# Altium schematic sheet SPI-主板-开关.SCHDOC
size A4; PageSetup: Record=PageOptions|CenterHorizontal=True|CenterVertical=True|PrintScale=0.96|XCorrection=1.00|YCorrection=1.00|PrintKind=2|BorderSize=5000000|LeftOffset=0|BottomOffset=0|Orientation=2|PaperLength=1000|PaperWidth=1000|Scale=100|PaperSource=7|PrintQuality=-4|MediaType=1|DitherType=10|PaperKind=A4|PrintScaleMode=1
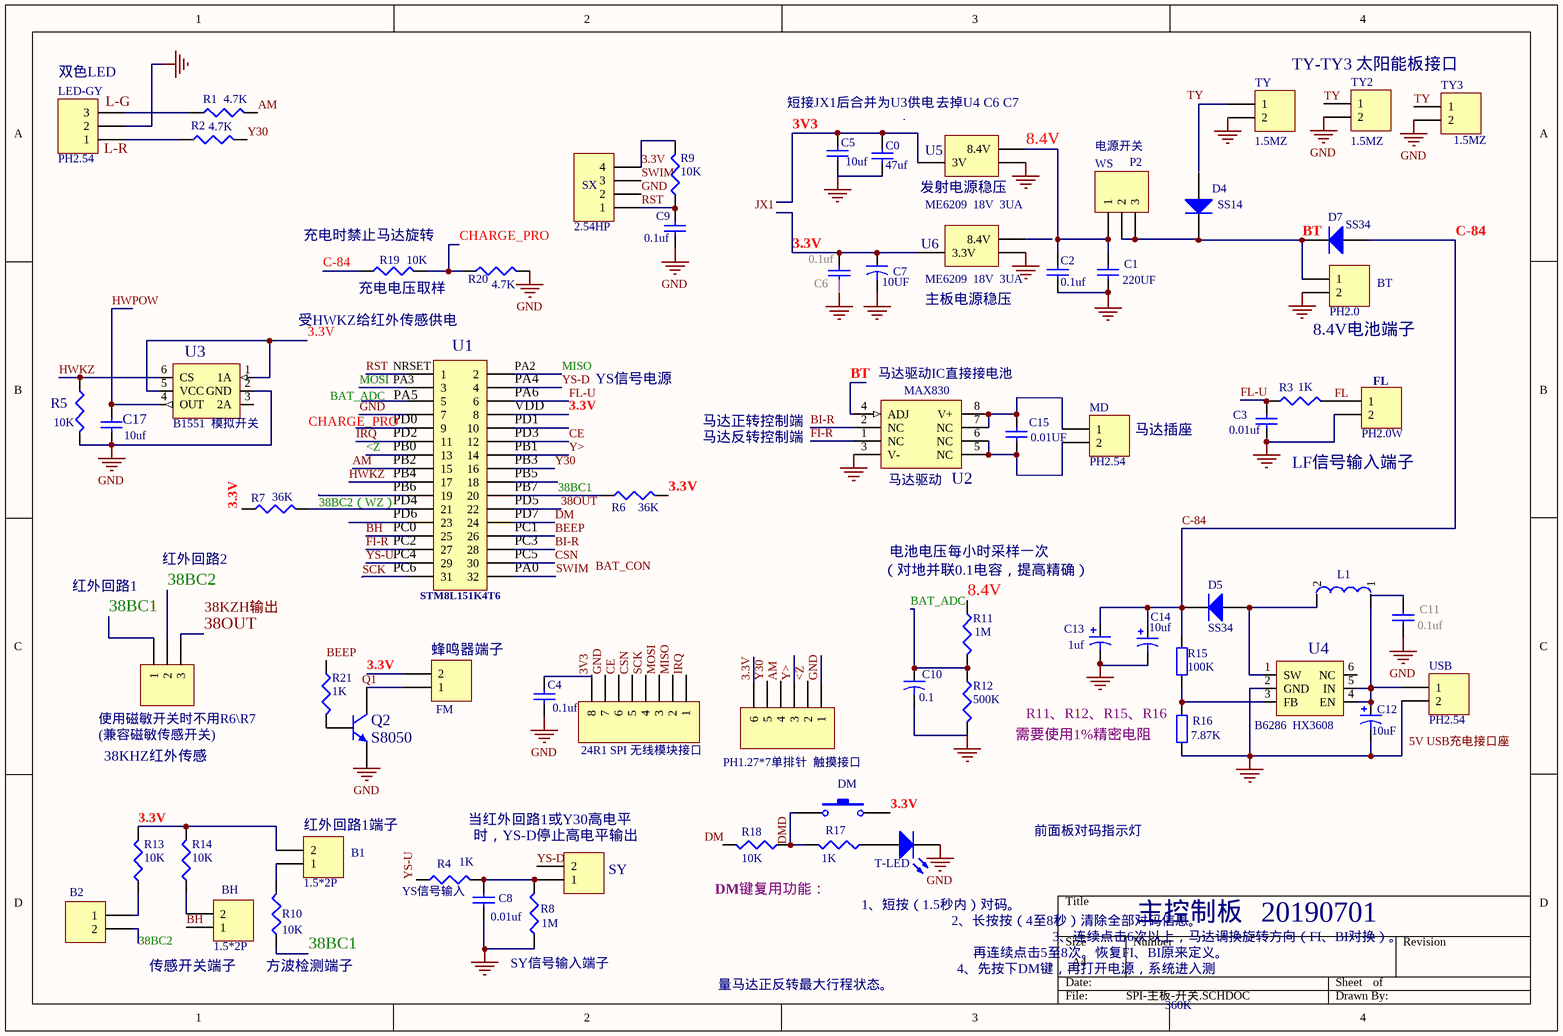
[diagram p0: SPI-主板-开关.SCHDOC]

## Parts
24R1_SPI_无线模块接口  Header 8  [HDR1X8]  (value not drawn)
(兼容磁敏传感开关)  PH2.0  [HDR1X3]  (value not drawn)
B1  1.5*2P  [HDR1X2]
B2  1.5*2P  [HDR1X2]  (value not drawn)
BH  1.5*2P  [HDR1X2]
BT  PH2.0  [HDR1X2]
C0  value 47uf  [CC1608-0603]
C1  value 220UF  [CC3216-1206]  (hidden comment: Cap Semi)
C2  value 0.1uf  [CC1608-0603]  (hidden comment: Cap Semi)
C3  0.01uf  [CC1608-0603]
C4  value 0.1uf  [CC1608-0603]
C5  10uf  [CC1608-0603]
C6  value 0.1uf  [CC1608-0603]  (hidden comment: 10UF)
C7  10UF  [CAPPR2-5x6.8]
C8  0.01uf  [CC1608-0603]
C9  value 0.1uf  [CC1608-0603]  (hidden comment: Cap Semi)
C10  value 0.1  [CAPPR2-5x6.8]  (hidden comment: 10UF)
C11  value 0.1uf  [CC3216-1206]  (hidden comment: Cap Semi)
C12  value 10uF  [C0805]  (hidden comment: Cap Pol1)
C13  value 1uf  [CC3216-1206]
C14  value 10uf  [CC3216-1206]
C15  0.01UF  [CC1608-0603]
C17  10uf  [CC1608-0603]
D4  SS14  [DIO7.1-3.9x1.9]
D5  SS34  [D0805]
D7  SS34  [D0805]
DM  (no value)  [SPST-2]
FL  PH2.0W  [HDR1X2]
FM  (no value)  [HDR1X2]
L1  (no value)  [L7]
LED-GY  PH2.54  [HDR1X3]
MD  PH2.54  [HDR1X2]
PH1.27*7单排针_触摸接口  Header 6  [HDR1X6]  (value not drawn)
Q2  S8050  [BCY-W3/E4]
R1  value 4.7K  [C1608-0603]
R2  value 4.7K  [C1608-0603]
R3  value 1K  [C1608-0603]
R4  value 1K  [C1608-0603]
R5  value 10K  [C1608-0603]
R6  value 36K  [C1608-0603]
R7  value 36K  [C1608-0603]
R8  value 1M  [C1608-0603]
R9  value 10K  [C1608-0603]
R10  value 10K  [C1608-0603]
R11  1M  value 360K  [C1608-0603]
R12  value 500K  [C1608-0603]
R13  value 10K  [C1608-0603]
R14  value 10K  [C1608-0603]
R15  value 100K  [C0805]  (hidden comment: Res2)
R16  value 7.87K  [C0805]  (hidden comment: Res2)
R17  value 1K  [C1608-0603]
R18  value 10K  [C1608-0603]
R19  10K  [C1608-0603]
R20  4.7K  [C1608-0603]
R21  value 1K  [C1608-0603]
SX  2.54HP  [HDR1X4]
SY  PH2.0WJ  [HDR1X2]  (value not drawn)
T-LED  (no value)  [LED-1]
TY  1.5MZ  [HDR1X2]
TY2  1.5MZ  [HDR1X2]
TY3  1.5MZ  [HDR1X2]
U1  STM8L151K4T6  [HDR2X16]
U2  马达驱动  Publisher: MAX830  [SO8]
U3  B1551  模拟开关  [2308]
U4  B6286  HX3608  [2308]
U5  ME6209  18V  3UA  [MHDR2X2]
U6  ME6209  18V  3UA  [MHDR2X2]
USB  PH2.54  [HDR1X2]
WS  P2  [HDR1X3]

## Nets
GND: 24R1_SPI_无线模块接口.7 BT.2 C0.1 C1.2 C2.1 C3.1 C4.1 C6.1 C7.2 C8.1 C9.1 C10.2 C11.2 C12.2 C13.2 C14.2 C17.1 FL.2 LED-GY.2 PH1.27*7单排针_触摸接口.1 R5.1 R8.1 R12.1 R16.2 R20.2 SX.2 T-LED.2(K) TY.2 TY2.2 TY3.2 U1.7 U2.3(V-) U3.2(GND) U4.2(GND) U5.3.3OUT U6.3.3OUT USB.2
3.3V: B1.2 C6.2 C7.1 DM.2 FM.2 PH1.27*7单排针_触摸接口.6 R6.2 R7.1 R9.2 R13.2 R14.2 SX.4 U1.8 U3.1(1A) U3.5(VCC) U6.2(3.3V)
3V3: 24R1_SPI_无线模块接口.8 C0.2 C4.2 C5.2 U5.2(3V)
8.4V: C1.1 C2.2 R11.2 U5.3.3_IN(8.4V) WS.1
38BC1: (兼容磁敏传感开关).1 R6.1 R10.1 U1.20
38BC2: (兼容磁敏传感开关).2
38OUT: (兼容磁敏传感开关).3 U1.22
<Z: PH1.27*7单排针_触摸接口.2 U1.13
AM: PH1.27*7单排针_触摸接口.4 R1.2 U1.15
BAT_ADC: C10.1 R11.1 R12.2
BEEP: R21.1 U1.26
BH: BH.1 U1.25
BI-R: U1.28 U2.2(NC)
BT: BT.1 D4.2(K) D7.2(K) U2.4(ADJ) WS.2 WS.3
C-84: C13.1 C14.1 D5.2(K) D7.1(A) R15.1 R19.1
CE: 24R1_SPI_无线模块接口.6 U1.12
CHARGE_PRO: R19.2 R20.1
CSN: 24R1_SPI_无线模块接口.5 U1.30
DM: U1.24
DMD: DM.1 R17.1 R18.2
FI-R: U1.27 U2.1(NC)
FL: FL.1 R3.2
FL-U: C3.2 R3.1 U1.6
HWKZ: R5.2 U1.17 U3.6(CS)
HWPOW: C17.2 U3.4(OUT)
IRQ: 24R1_SPI_无线模块接口.1 U1.11
MISO: 24R1_SPI_无线模块接口.2 U1.2  [also labelled PA2]
MOSI: 24R1_SPI_无线模块接口.3 U1.3  [also labelled PA3]
NRSET: C9.2 R9.1 SX.1 U1.1  [also labelled RST]
SCK: 24R1_SPI_无线模块接口.4 U1.31
SWIM: SX.3 U1.32
TY: TY2.1 TY3.1
Y30: PH1.27*7单排针_触摸接口.5 R2.2 U1.16
Y>: PH1.27*7单排针_触摸接口.3 U1.14
YS-D: SY.2 U1.4
YS-U: R4.1 U1.29
NetB1_1: B1.1 R10.2
NetB2_1: B2.1 R13.1
NetBH_2: BH.2 R14.1
NetC8_2: C8.2 R4.2 R8.2 SY.1
NetC12_1: C12.1 L1.1 U4.4(EN) U4.5(IN) USB.1
NetC15_1: C15.1 MD.2 U2.5(NC) U2.6(NC)
NetC15_2: C15.2 MD.1 U2.7(NC) U2.8(V+)
NetD5_1: D5.1(A) L1.2 U4.1(SW)
NetFM_1: FM.1 Q2.3(C)
NetLED-GY_1: LED-GY.1 R2.1
NetLED-GY_3: LED-GY.3 R1.1
NetQ2_2: Q2.2(B) R21.2
NetR7_2: R7.2 U1.21
NetR15_2: R15.2 R16.1 U4.3(FB)
NetR17_2: R17.2 T-LED.1(A)

Not connected (* = marked no-connect by the designer): B2 2; C5 1; C11 1; D4 1(A); Q2 1(E); R18 1; TY 1; U1 5 9 10 18 19 23; U3 3(2A); U4 6(NC); U6 3.3 IN(8.4V)

## Notes on the sheet
- (near LED-GY) 双色LED
- 短接JX1后合并为U3供电
- (near U5) 去掉U4 C6 C7
- TY-TY3 太阳能板接口
- 电源开关
- (near R19) 充电时禁止马达旋转
- (near U5) 发射电源稳压
- (near R19) 充电电压取样
- 主板电源稳压
- (near U3) 受HWKZ给红外传感供电
- (near U1) PA4
- YS信号电源
- (near U2) 马达驱动IC直接接电池
- (near BT) 8.4V电池端子
- (near U1) PD0
- (near U1) PD2
- (near U1) PB0
- (near U1) PA5
- (near U1) PA6
- (near U1) PD1
- (near U1) PD3
- (near U1) PB1
- (near U1) VDD
- 马达正转控制端
- 马达反转控制端
- (near MD) 马达插座
- (near U1) PD4
- (near U1) PD6
- (near U1) PB2
- (near U1) PB4
- (near U1) PB6
- (near U1) PD5
- (near U1) PD7
- (near U1) PB3
- (near U1) PB5
- (near U1) PB7
- LF信号输入端子
- 红外回路2
- (near U1) PC0
- (near U1) PC2
- (near U1) PC4
- (near U1) PC6
- (near U1) PA0
- (near U1) PC1
- (near U1) PC3
- (near U1) PC5
- (near R11) （对地并联0.1电容，提高精确）
- (near R11) 电池电压每小时采样一次
- 红外回路1
- (near FM) 蜂鸣器端子
- R11、R12、R15、R16
- (near (兼容磁敏传感开关)) 使用磁敏开关时不用R6\R7
- 38KHZ红外传感
- (near R12) 需要使用1%精密电阻
- (near B1) 红外回路1端子
- 当红外回路1或Y30高电平
- 时，YS-D停止高电平输出
- 前面板对码指示灯
- (near R4) YS信号输入
- DM键复用功能：
- 1、短按（1.5秒内）对码。
- 主控制板
- 20190701
- (near B2) 传感开关端子
- 方波检测端子
- (near R8) SY信号输入端子
- 量马达正反转最大行程状态。
- 2、长按按（4至8秒）清除全部对码信息。
- 4、先按下DM键，再打开电源，系统进入测
- 再连续点击5至8次。恢复FI、BI原来定义。
- 3、连续点击6次以上，马达调换旋转方向（FI、BI对换）。
- Labels drawn without touching a wire or pin: 5V USB充电接口座, 38BC2, 38BC2（WZ）, 38KZH输出, BAT_ADC, BAT_CON, CHARGE_PRO, DM, GND, JX1, L-G, L-R, Q1, TY

## Library data of the parts
24R1_SPI_无线模块接口 = Header 8: Header, 8-Pin; LatestRevisionDate: 17-Jul-2002; LatestRevisionNote: Re-released for DXP Platform.; Publisher: Altium Limited
(兼容磁敏传感开关) LED-GY WS = Header 3: Header, 3-Pin; LatestRevisionDate: 17-Jul-2002; LatestRevisionNote: Re-released for DXP Platform.; Publisher: Altium Limited
B1 B2 BH BT FL FM MD SY TY TY2 TY3 USB = Header 2: Header, 2-Pin; LatestRevisionDate: 17-Jul-2002; LatestRevisionNote: Re-released for DXP Platform.; Publisher: Altium Limited
C0-C6 C9 C11 C15 C17 = Cap Semi: Capacitor (Semiconductor SIM Model); Published: 8-Jun-2000; LatestRevisionDate: 17-Jul-2002; LatestRevisionNote: Re-released for DXP Platform.; PackageReference: C1206; Publisher: Altium Limited
  C5: Value: 10uf
  C15: Value: 0.01UF
C7 C10 = Cap2: Capacitor; Published: 23-Sep-2002; Publisher: Altium Limited
  C7: Value: 10UF
C8 = Cap Semi: Capacitor (Semiconductor SIM Model); Value: 100pF; Published: 8-Jun-2000; LatestRevisionDate: 17-Jul-2002; LatestRevisionNote: Re-released for DXP Platform.; PackageReference: C1206; Publisher: Altium Limited
C12-C14 = Cap Pol1: Polarized Capacitor (Radial); Published: 8-Jun-2000; LatestRevisionDate: 17-Jul-2002; LatestRevisionNote: Re-released for DXP Platform.; PackageReference: RB7.6-15; Publisher: Altium Limited; PackageDescription: Polarized Capacitor (Radial); 2 Leads
D4 = Diode 1N914: High Conductance Fast Diode; Published: 8-Jun-2000; LatestRevisionDate: 17-Jul-2002; LatestRevisionNote: Re-released for DXP Platform.; Publisher: Altium Limited; PackageReference: DO-35; DatasheetDocument: 1997; Code_JEDEC: DO-204-AH
D5 D7 = Diode: Default Diode; Published: 8-Jun-2000; LatestRevisionDate: 17-Jul-2002; LatestRevisionNote: Re-released for DXP Platform.; PackageVersion: Sep-1996; PackageReference: SMC; Publisher: SS24; PackageDescription: DO-214-AB/SMC; 2 C-Bend Leads; Body 7.9 x 5.9 mm, inc. leads (LxW); Code_JEDEC: DO-214-AB
DM = SW-PB: Switch; Published: 24-Mar-1999; LatestRevisionDate: 17-Jul-2002; LatestRevisionNote: Re-released for DXP Platform.; Publisher: Altium Limited
L1 = L
PH1.27*7单排针_触摸接口 = Header 6: Header, 6-Pin; LatestRevisionDate: 17-Jul-2002; LatestRevisionNote: Re-released for DXP Platform.; Publisher: Altium Limited
Q2 = 2N3904: NPN General Purpose Amplifier; Published: 8-Jun-2000; LatestRevisionDate: 15-Jan-2003; LatestRevisionNote: PCB Footprint 'BCY-W3/D4.7' replaced; DatasheetDocument: 1997; PackageReference: TO-92A; Publisher: Altium Limited; Code_JEDEC: TO-92A
R1-R14 R17-R21 = Res3: Resistor; Published: 8-Jun-2000; LatestRevisionDate: 17-Jul-2002; LatestRevisionNote: Re-released for DXP Platform.; Publisher: Altium Limited
R15 R16 = Res2: Resistor; Published: 8-Jun-2000; LatestRevisionDate: 17-Jul-2002; LatestRevisionNote: Re-released for DXP Platform.; PackageReference: AXIAL-0.4; Publisher: Altium Limited; PackageDescription: Axial Device, Thru-Hole; 2 Leads; 0.4 in Pin Spacing
SX = Header 4: Header, 4-Pin; LatestRevisionDate: 17-Jul-2002; LatestRevisionNote: Re-released for DXP Platform.; Publisher: Altium Limited
T-LED = LED1: Typical RED GaAs LED; Published: 8-Jun-2000; LatestRevisionDate: 17-Jul-2002; LatestRevisionNote: Re-released for DXP Platform.; Publisher: Altium Limited
U1 = Header 16X2: Header, 16-Pin, Dual row; LatestRevisionDate: 17-Jul-2002; LatestRevisionNote: Re-released for DXP Platform.; Publisher: Altium Limited
U2 = LM135D: Precision Temperature Sensor; Published: 24-Aug-2001; LatestRevisionDate: 17-Jul-2002; LatestRevisionNote: Re-released for DXP Platform.; DatasheetDocument: Oct-1997; PackageDocument: Jul-1998; PackageReference: SO8; Code_JEDEC: MS-012-AA; Code_IPC: SO8
U3 = 1308
U4 = 1308: 1308A: u4
U5 U6 = MHDR2X2: Header, 2-Pin, Dual row; LatestRevisionDate: 17-Jul-2002; LatestRevisionNote: Re-released for DXP Platform.; Publisher: Altium Limited